# Altium schematic sheet buffers_5bits.SchDoc
size A4
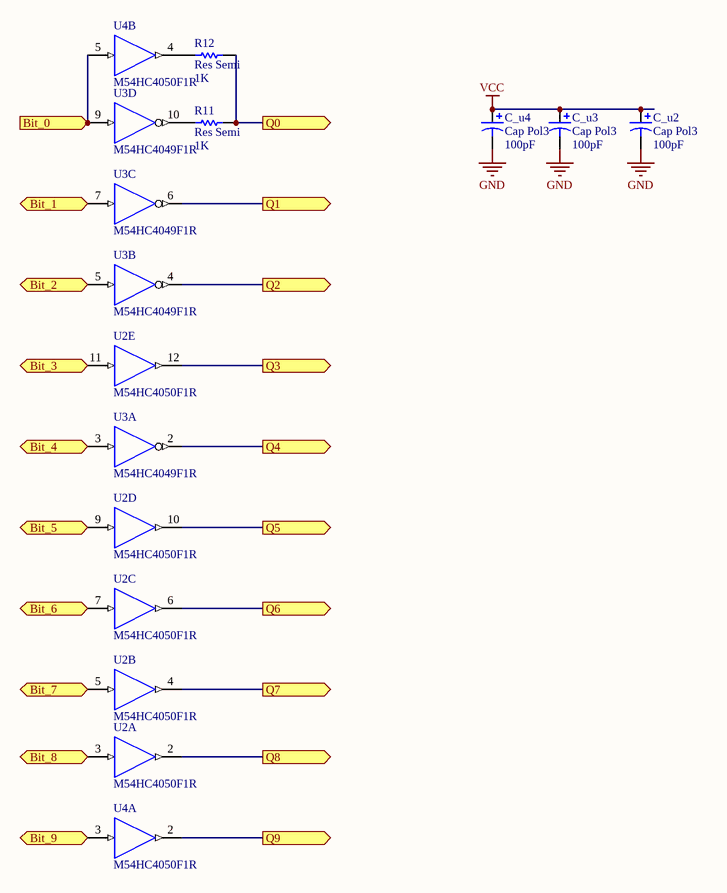
[diagram p0: buffers_5bits.SchDoc]

## Parts
C_u2  Cap Pol3  value 100pF  [C0805]
C_u3  Cap Pol3  value 100pF  [C0805]
C_u4  Cap Pol3  value 100pF  [C0805]
R11  Res Semi  value 1K  [2012[0805]]
R12  Res Semi  value 1K  [2012[0805]]
U2  M54HC4050F1R  [DIP16]  (parts A,B,C,D,E of 6)
U3  M54HC4049F1R  [DIP16]  (parts A,B,C,D of 6)
U4  M54HC4050F1R  [DIP16]  (parts A,B of 6)

## Ports
Bit_0 (in), Bit_1 (in), Bit_2 (in), Bit_3 (in), Bit_4 (in), Bit_5 (out), Bit_6 (out), Bit_7 (out), Bit_8 (out), Bit_9 (out), Q0 (out), Q1 (out), Q2 (out), Q3 (out), Q4 (out), Q5 (out), Q6 (out), Q7 (out), Q8 (out), Q9 (out)

## Nets
GND: C_u2.2 C_u3.2 C_u4.2 U2.8(GND) U3.8(GND) U4.8(GND)
VCC: C_u2.1 C_u3.1 C_u4.1 U2.1(VCC) U3.1(VCC) U4.1(VCC)
Bit_0: U3.9(A) U4.5(A) ; port Bit_0
Bit_1: U3.7(A) ; port Bit_1
Bit_2: U3.5(A) ; port Bit_2
Bit_3: U2.11(A) ; port Bit_3
Bit_4: U3.3(A) ; port Bit_4
Bit_5: U2.9(A) ; port Bit_5
Bit_6: U2.7(A) ; port Bit_6
Bit_7: U2.5(A) ; port Bit_7
Bit_8: U2.3(A) ; port Bit_8
Bit_9: U4.3(A) ; port Bit_9
Q0: R11.1 R12.1 ; port Q0
Q1: U3.6(Y) ; port Q1
Q2: U3.4(Y) ; port Q2
Q3: U2.12(Y) ; port Q3
Q4: U3.2(Y) ; port Q4
Q5: U2.10(Y) ; port Q5
Q6: U2.6(Y) ; port Q6
Q7: U2.4(Y) ; port Q7
Q8: U2.2(Y) ; port Q8
Q9: U4.2(Y) ; port Q9
NetR11_2: R11.2 U3.10(Y)
NetR12_2: R12.2 U4.4(Y)

## Library data of the parts
C_u2-C_u4 = Cap Pol3: Polarized Capacitor (Surface Mount); Published: 8-Jun-2000; LatestRevisionDate: 17-Jul-2002; LatestRevisionNote: Re-released for DXP Platform.; PackageReference: C0805; Publisher: Altium Limited
R11 R12 = Res Semi: Semiconductor Resistor; Published: 8-Jun-2000; LatestRevisionDate: 17-Jul-2002; LatestRevisionNote: Re-released for DXP Platform.; PackageReference: AXIAL-0.5; Publisher: Altium Limited
U2 U4 = M54HC4050F1R: Hex Buffer/Converter Non-Inverting; Note: Pins 13 and 16 are not connected and not drawn.; Published: 8-Jun-2000; LatestRevisionDate: 06-Jun-2005; LatestRevisionNote: Stylized 3D Model Added.; DatasheetVersion: Mar-1993; PackageVersion: Apr-1996; PackageReference: DIP16; Publisher: Altium Limited; PackageDescription: DIP; 16 Leads; Row Spacing 7.62 mm; Pitch 2.54 mm; ComponentLink1Description: Manufacturer Link; ComponentLink1URL: http://www.st.com/
U3 = M54HC4049F1R: Hex Buffer/Converter Invertering; Note: Pins 13 and 16 are not connected and not drawn.; Published: 8-Jun-2000; LatestRevisionDate: 06-Jun-2005; LatestRevisionNote: Stylized 3D Model Added.; DatasheetVersion: Mar-1993; PackageVersion: Apr-1996; PackageReference: DIP16; Publisher: Altium Limited; PackageDescription: DIP; 16 Leads; Row Spacing 7.62 mm; Pitch 2.54 mm; ComponentLink1Description: Manufacturer Link; ComponentLink1URL: http://www.st.com/